# Altium schematic sheet DP83640.SchDoc
size A3; SheetNumber: 6; SheetTotal: 14
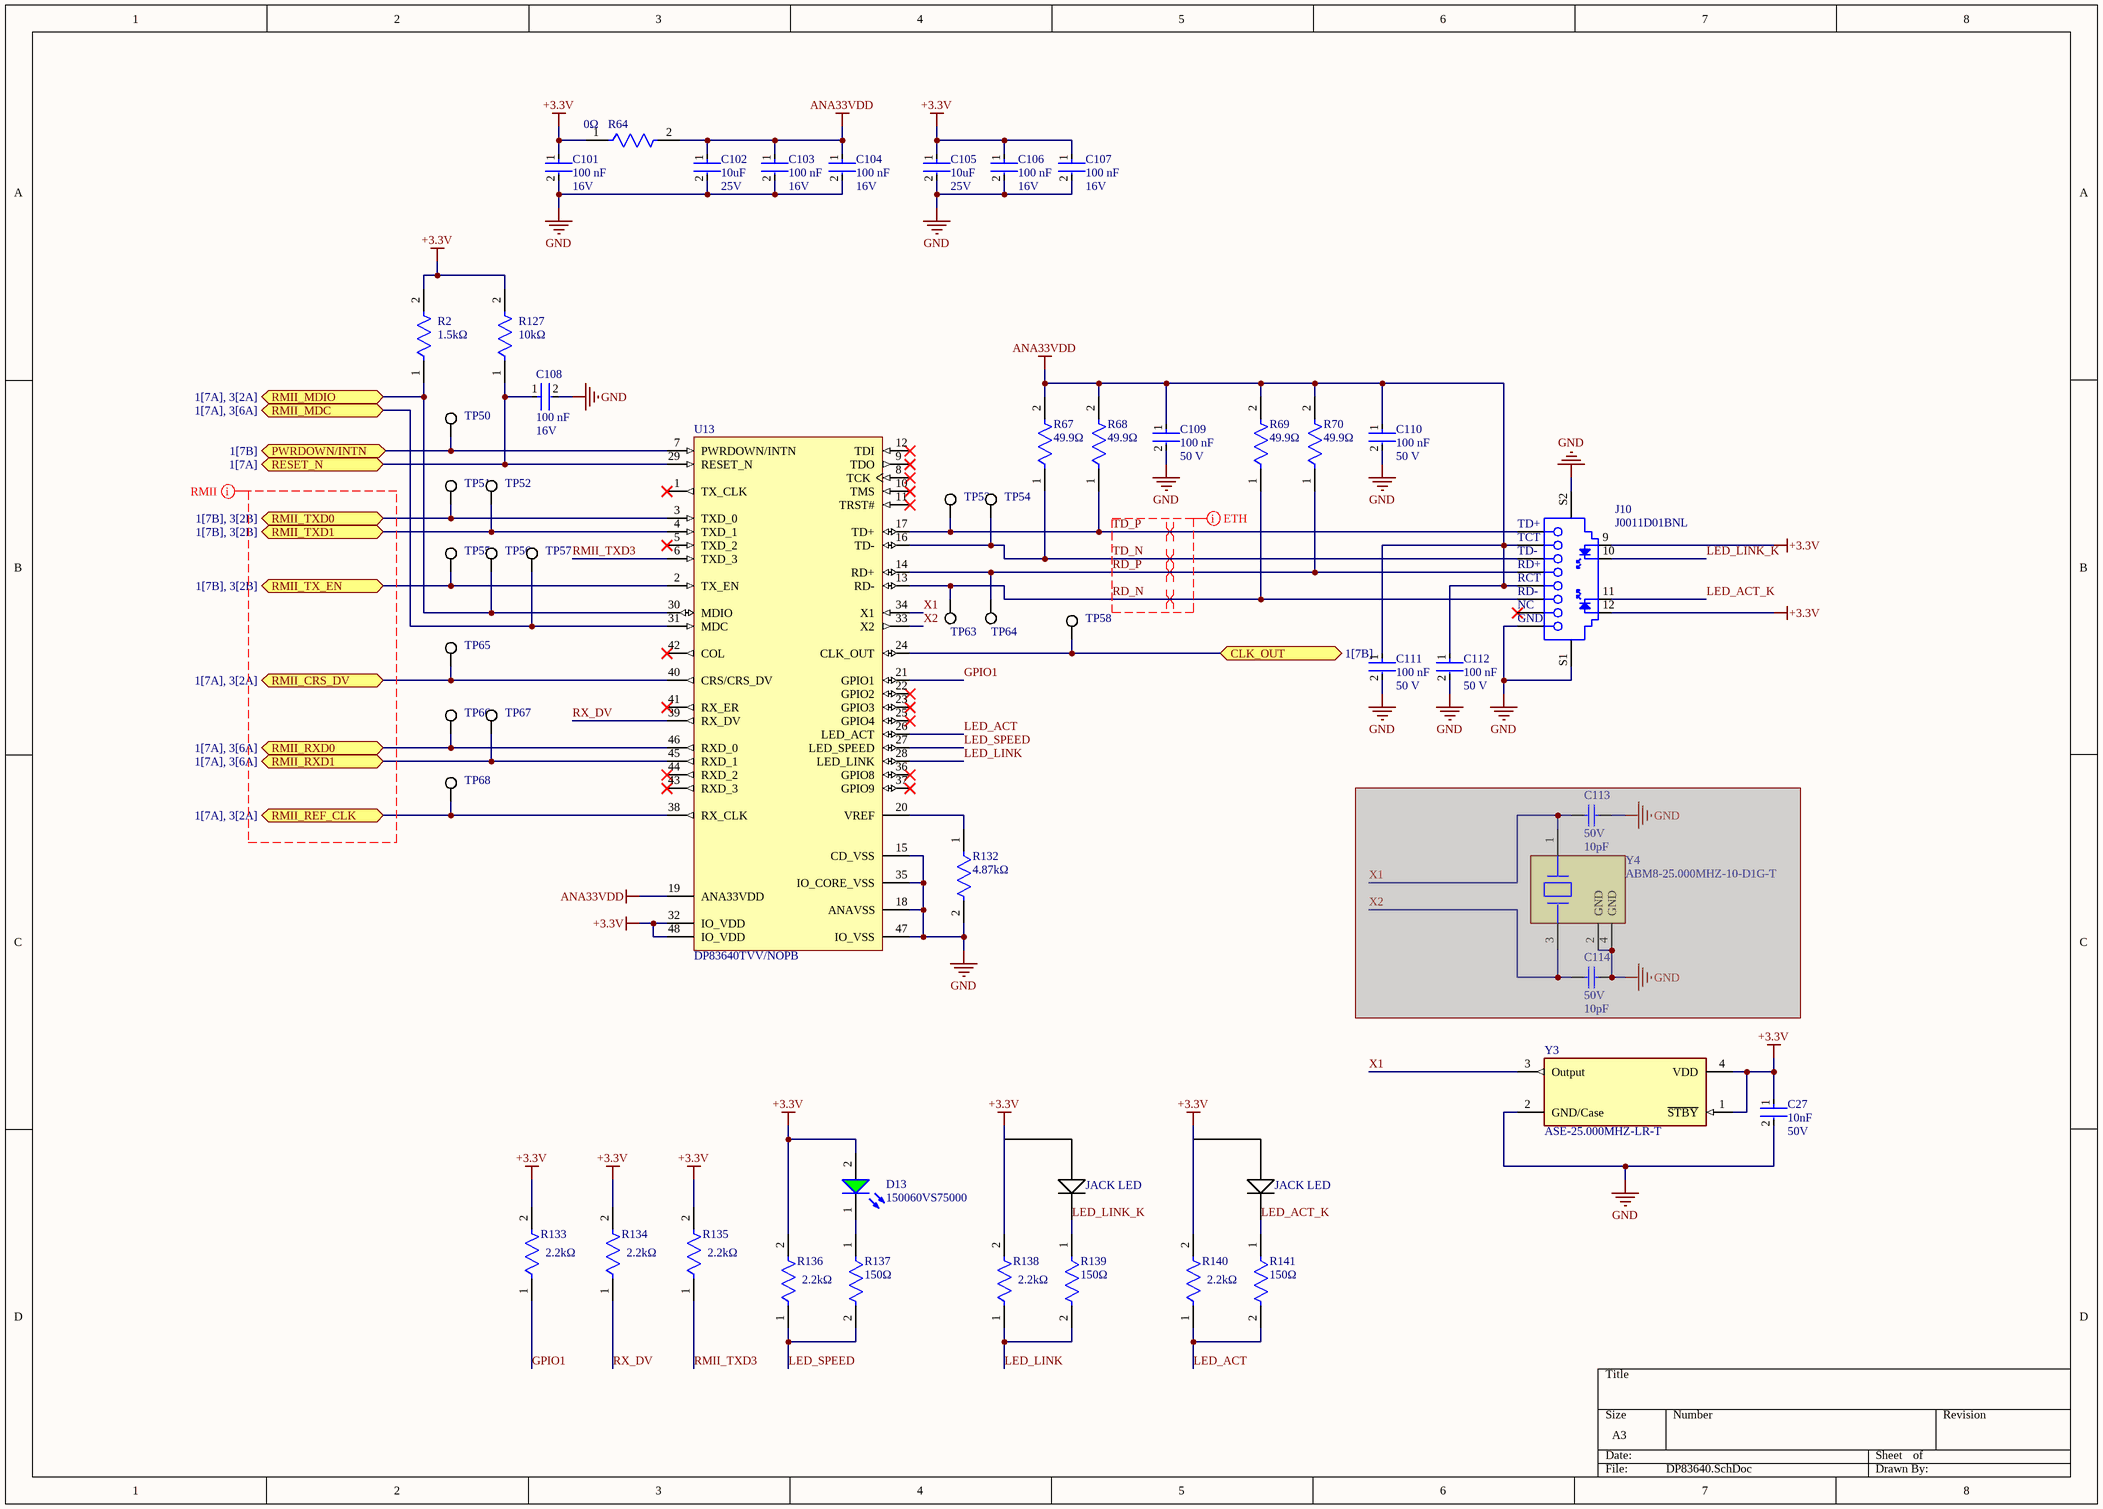
[diagram p0: DP83640.SchDoc]

## Parts
C27  Voltage: 50V  Capacitance: 10nF  [FP-CL165-IPC_B]  (hidden comment: CL05B103KB5NNNC)
C101  Capacitance: 100 nF  Voltage Rating: 16V  [FP-CL752-IPC_B]  (hidden comment: CL05B104KO5VPNC)
C102  Voltage Rating: 25V  Capacitance: 10uF  [FP-C1608-080-IPC_B]  (hidden comment: C1608X5R1E106M080AC)
C103  Capacitance: 100 nF  Voltage Rating: 16V  [FP-CL752-IPC_B]  (hidden comment: CL05B104KO5VPNC)
C104  Capacitance: 100 nF  Voltage Rating: 16V  [FP-CL752-IPC_B]  (hidden comment: CL05B104KO5VPNC)
C105  Voltage Rating: 25V  Capacitance: 10uF  [FP-C1608-080-IPC_B]  (hidden comment: C1608X5R1E106M080AC)
C106  Capacitance: 100 nF  Voltage Rating: 16V  [FP-CL752-IPC_B]  (hidden comment: CL05B104KO5VPNC)
C107  Capacitance: 100 nF  Voltage Rating: 16V  [FP-CL752-IPC_B]  (hidden comment: CL05B104KO5VPNC)
C108  Capacitance: 100 nF  Voltage Rating: 16V  [FP-CL752-IPC_B]  (hidden comment: CL05B104KO5VPNC)
C109  value 100 nF  Voltage Rating: 50 V  [FP-C0603C-CF-IPC_B]  (hidden comment: C0603C104M5RACTU)
C110  value 100 nF  Voltage Rating: 50 V  [FP-C0603C-CF-IPC_B]  (hidden comment: C0603C104M5RACTU)
C111  value 100 nF  Voltage Rating: 50 V  [FP-C0603C-CF-IPC_B]  (hidden comment: C0603C104M5RACTU)
C112  value 100 nF  Voltage Rating: 50 V  [FP-C0603C-CF-IPC_B]  (hidden comment: C0603C104M5RACTU)
C113  Voltage Rating: 50V  Capacitance: 10pF  [CAPC1005X55X25NL05T05]  (hidden comment: CC0402JRNPO9BN100)  (masked out: inside a compile mask, not in the netlist)
C114  Voltage Rating: 50V  Capacitance: 10pF  [CAPC1005X55X25NL05T05]  (hidden comment: CC0402JRNPO9BN100)  (masked out: inside a compile mask, not in the netlist)
D13  150060VS75000  [WL-SMCW_0603_150060xx75000]
J10  J0011D01BNL  [J0011D01BNL]
R2  Resistance: 1.5kΩ  [FP-CRCW0603-e3-IPC_B]  (hidden comment: CRCW06031K50FKEA)
R64  Resistance: 0Ω  [FP-CRCW0603-HPe3-IPC_B]  (hidden comment: CRCW06030000Z0EAHP)
R67  Resistance: 49.9Ω  [FP-AC0603-IPC_B]  (hidden comment: AC0603FR-0749R9L)
R68  Resistance: 49.9Ω  [FP-AC0603-IPC_B]  (hidden comment: AC0603FR-0749R9L)
R69  Resistance: 49.9Ω  [FP-AC0603-IPC_B]  (hidden comment: AC0603FR-0749R9L)
R70  Resistance: 49.9Ω  [FP-AC0603-IPC_B]  (hidden comment: AC0603FR-0749R9L)
R127  Resistance: 10kΩ  [FP-RC0603-0_55-IPC_B]  (hidden comment: RC0603FR-0710KL)
R132  Resistance: 4.87kΩ  [FP-CRCW0603-e3-IPC_B]  (hidden comment: CRCW06034K87FKEA)
R133  Resistance: 2.2kΩ  [FP-AC0603-IPC_B]  (hidden comment: AC0603FR-072K2L)
R134  Resistance: 2.2kΩ  [FP-AC0603-IPC_B]  (hidden comment: AC0603FR-072K2L)
R135  Resistance: 2.2kΩ  [FP-AC0603-IPC_B]  (hidden comment: AC0603FR-072K2L)
R136  Resistance: 2.2kΩ  [FP-AC0603-IPC_B]  (hidden comment: AC0603FR-072K2L)
R137  Resistance: 150Ω  [FP-CRCW0603-e3-IPC_B]  (hidden comment: CRCW0603150RFKEA)
R138  Resistance: 2.2kΩ  [FP-AC0603-IPC_B]  (hidden comment: AC0603FR-072K2L)
R139  Resistance: 150Ω  [FP-CRCW0603-e3-IPC_B]  (hidden comment: CRCW0603150RFKEA)
R140  Resistance: 2.2kΩ  [FP-AC0603-IPC_B]  (hidden comment: AC0603FR-072K2L)
R141  Resistance: 150Ω  [FP-CRCW0603-e3-IPC_B]  (hidden comment: CRCW0603150RFKEA)
TP50  5019  [KSTN-5019_V]  (value not drawn)
TP51  5019  [KSTN-5019_V]  (value not drawn)
TP52  5019  [KSTN-5019_V]  (value not drawn)
TP53  5019  [KSTN-5019_V]  (value not drawn)
TP54  5019  [KSTN-5019_V]  (value not drawn)
TP55  5019  [KSTN-5019_V]  (value not drawn)
TP56  5019  [KSTN-5019_V]  (value not drawn)
TP57  5019  [KSTN-5019_V]  (value not drawn)
TP58  5019  [KSTN-5019_V]  (value not drawn)
TP63  5019  [KSTN-5019_V]  (value not drawn)
TP64  5019  [KSTN-5019_V]  (value not drawn)
TP65  5019  [KSTN-5019_V]  (value not drawn)
TP66  5019  [KSTN-5019_V]  (value not drawn)
TP67  5019  [KSTN-5019_V]  (value not drawn)
TP68  5019  [KSTN-5019_V]  (value not drawn)
U13  DP83640TVV/NOPB  [PT0048A_M]
Y3  ASE-25.000MHZ-LR-T  [FP-ASE-MFG]
Y4  ABM8-25.000MHZ-10-D1G-T  [FP-ABM8-MFG]  (masked out: inside a compile mask, not in the netlist)

## Ports
CLK_OUT (bidir, see 1[7B]), PWRDOWN/INTN (bidir, see 1[7B]), RESET_N (bidir, see 1[7A]), RMII_CRS_DV (bidir, see 1[7A], 3[2A]), RMII_MDC (bidir, see 1[7A], 3[6A]), RMII_MDIO (bidir, see 1[7A], 3[2A]), RMII_REF_CLK (bidir, see 1[7A], 3[2A]), RMII_RXD0 (bidir, see 1[7A], 3[6A]), RMII_RXD1 (bidir, see 1[7A], 3[6A]), RMII_TX_EN (bidir, see 1[7B], 3[2B]), RMII_TXD0 (bidir, see 1[7B], 3[2B]), RMII_TXD1 (bidir, see 1[7B], 3[2B])

## Nets
+3.3V: C27.1 C101.1 C105.1 C106.1 C107.1 D13.2(A) J10.9 J10.12 R2.2 R64.1 R127.2 R133.2 R134.2 R135.2 R136.2 R138.2 R140.2 U13.32(IO_VDD) U13.48(IO_VDD) Y3.1(~{STBY}) Y3.4(VDD)
ANA33VDD: C102.1 C103.1 C104.1 C109.1 C110.1 C111.1 C112.1 J10.2(TCT) J10.5(RCT) R64.2 R67.2 R68.2 R69.2 R70.2 U13.19(ANA33VDD)
GND: C27.2 C101.2 C102.2 C103.2 C104.2 C105.2 C106.2 C107.2 C108.2 C109.2 C110.2 C111.2 C112.2 J10.8(GND) J10.S1 J10.S2 R132.2 U13.15(CD_VSS) U13.18(ANAVSS) U13.35(IO_CORE_VSS) U13.47(IO_VSS) Y3.2(GND/Case)
CLK_OUT: TP58.1 U13.24(CLK_OUT) ; port CLK_OUT
GPIO1: R133.1 U13.21(GPIO1)
LED_ACT: R140.1 R141.2 U13.26(LED_ACT)
LED_ACT_K: J10.11 R141.1
LED_LINK: R138.1 R139.2 U13.28(LED_LINK)
LED_LINK_K: J10.10 R139.1
LED_SPEED: R136.1 R137.2 U13.27(LED_SPEED)
PWRDOWN/INTN: TP50.1 U13.7(PWRDOWN/INTN) ; port PWRDOWN/INTN
RD_N: J10.6(RD-) R69.1 TP63.1 U13.13(RD-)
RD_P: J10.4(RD+) R70.1 TP64.1 U13.14(RD+)
RESET_N: C108.1 R127.1 U13.29(RESET_N) ; port RESET_N
RMII_CRS_DV: TP65.1 U13.40(CRS/CRS_DV) ; port RMII_CRS_DV
RMII_MDC: TP57.1 U13.31(MDC) ; port RMII_MDC
RMII_MDIO: R2.1 TP56.1 U13.30(MDIO) ; port RMII_MDIO
RMII_REF_CLK: TP68.1 U13.38(RX_CLK) ; port RMII_REF_CLK
RMII_RXD0: TP66.1 U13.46(RXD_0) ; port RMII_RXD0
RMII_RXD1: TP67.1 U13.45(RXD_1) ; port RMII_RXD1
RMII_TX_EN: TP55.1 U13.2(TX_EN) ; port RMII_TX_EN
RMII_TXD0: TP51.1 U13.3(TXD_0) ; port RMII_TXD0
RMII_TXD1: TP52.1 U13.4(TXD_1) ; port RMII_TXD1
RMII_TXD3: R135.1 U13.6(TXD_3)
RX_DV: R134.1 U13.39(RX_DV)
TD_N: J10.3(TD-) R67.1 TP54.1 U13.16(TD-)
TD_P: J10.1(TD+) R68.1 TP53.1 U13.17(TD+)
X1: U13.34(X1) Y3.3(Output)
X2: U13.33(X2)
NetD13_1: D13.1(K) R137.1
NetR132_1: R132.1 U13.20(VREF)

Not connected (* = marked no-connect by the designer): J10 7(NC)*; U13 1(TX_CLK)* 5(TXD_2)* 8(TCK)* 9(TDO)* 10(TMS)* 11(TRST#)* 12(TDI)* 22(GPIO2)* 23(GPIO3)* 25(GPIO4)* 36(GPIO8)* 37(GPIO9)* 41(RX_ER)* 42(COL)* 43(RXD_3)* 44(RXD_2)*

## Layout directives
differential pair: RD_N, RD_P, TD_N, TD_P
rule Matched Net Lengths [Tolerance = 0.5mm]; rule Width Constraint [Pref Impedance = 50.00ohms    Min Impedance = 50.00ohms    Max Impedance = 50.00ohms]; net class RMII: (no net found under the mark)
net class ETH; rule Differential Pairs Routing [Pref Gap = 0.254mm    Min Gap  = 0.254mm    Max Gap  = 0.254mmPref Width = 0.121mm    Min Width  = 0.096mm    Max Width  = 0.152mm]: RD_N, RD_P, TD_N, TD_P

## Notes on the sheet
- JACK LED

## Library data of the parts
C27 = CMP-13271-000387-1: Cap Ceramic 10nF 50V X7R ±10% SMD 0402 +125°C Paper T/R; Depth: 0.5mm; Length: 1mm; Lead Free: Lead Free; Case Code (Metric): 1005; Width: 0.02inch; Min Operating Temperature: -55°C; Thickness: 0.022inch; Package Quantity: 1; Mount: Surface Mount; Height: 0.5mm; Material: Ceramic; Tolerance: 10%; Case Code (Imperial): 0402; Radiation Hardening: No; Case/Package: 0402; Max Operating Temperature: 125°C; Voltage Rating (DC): 50V; Contact Plating: Tin; Packaging: Tape and Reel; Voltage Rating: 50V; Dielectric: X7R
C101 C103 C104 C106-C108 = CMP-13271-002128-1: Cap Ceramic 100nF 16V X7R ±10% SMD 0402 +125°C Paper T/R; Length: 0.039inch; Case Code (Metric): 1005; Thickness: 0.022inch; Max Operating Temperature: 125°C; Mount: Surface Mount; Features: Soft Termination; Width: 0.02inch; Min Operating Temperature: -55°C; Tolerance: 10%; Case/Package: 0402; Packaging: Cut Tape; Ratings: AEC-Q200; Case Code (Imperial): 0402; Lead Free: Lead Free
C102 C105 = CMP-2000-05442-2: CAP CER 10UF 25V X5R 0603; Dielectric Material: Ceramic; Tolerance: 20%; Dielectric: X5R; Length: 1.6mm; Termination: SMD/SMT; Depth: 0.8mm; RoHS Compliant: Yes; Construction: Flat; Weight: 7.1E-05oz; Thickness: 0.039inch; Packaging: Tape and Reel; Min Operating Temperature: -55°C; Case Code (Imperial): 0603; Case/Package: 0603; Height: 0.8mm; Case Code (Metric): 1608; Resistor Type: Ceramic; Voltage Rating (DC): 25V; Max Operating Temperature: 85°C; REACH SVHC: No SVHC; Lead Free: Lead Free; Series: C; Width: 0.8mm; Mount: Surface Mount; Package Quantity: 1
C109-C112 = CMP-2006-03068-2: CAP CER 0.1UF 50V 20% X7R 0603; Manufacturer: KEMET; Material: Ceramic; Tolerance: 0.2; Temperature Coefficient: 30ppm/°C; Automotive Grade: Grade 1; Capacitance: 0.10 μF; Temperature Range High: +125°C; Device Class L3: Ceramic Capacitors; Manufacturer Part Number: C0603C104M5RACTU; Height: 0.87mm; Category: Cap; RoHS: TRUE; Digikey Description: CAP CER 0.1UF 50V 20% X7R 0603; ComponentLink2URL: https://api.kemet.com/component-edge/download/datasheet/C0603C100J5GACAUTO.pdf; Lead Free: Yes; Temperature Range Low: -55°C; Device Class L1: Passive Components; ComponentLink2Description: Datasheet; Temperature Characteristic: X7R; Automotive: Yes; Temperature: -55°C to +125°C; Octopart: https://octopart.com/c0603c104m5ractu-kemet-11855687; Device Class L2: Capacitors; Package: C0603C-CF; Mouser Description: Multilayer Ceramic Capacitors MLCC - SMD/SMT 50volts 0.1uF X7R 20%
C113 C114 = CMP-2100-03589-1: Chip Capacitor, 10 pF, +/- 5%, 50 V, -55 to 125 degC, 0402 (1005 Metric), RoHS, Tape and Reel; Manufacturer: Yageo; Insulation Resistance: 100GR; Dielectric Material: Ceramic; Temperature Coefficient: 30ppm/degC; Dielectric: C0G; Termination: SMD/SMT; Package Reference: 0402; Voltage Rating (DC): 50V; Lead Free: LeadFree; Composition: Ceramic; Tolerance: 5%; Case Code (Metric): 1005; Packaging: TapeandReel; Manufacturer URL: http://www.yageo.com/; REACH SVHC: NoSVHC; Max Operating Temperature: 125degC; Length: 1mm; Mount: SurfaceMount; Depth: 0.5mm; Min Operating Temperature: -55degC; Number of Pins: 2; Width: 0.02inch; Datasheet Version: Rev. 14, 07/2016; Package Quantity: 1; Datasheet URL: http://www.yageo.com/documents/recent/UPY-GP_NP0_16V-to-50V_14.pdf; Case Code (Imperial): 0402; RoHSCompliant: True; Radiation Hardening: No; Height: 0.5mm; Case/Package: 0402; Thickness: 0.022inch; Package Description: 2-Pin Surface Mount Device, Body 1 x 0.5 mm; Voltage: 50V
D13 = CMP-1426-00006-6: NexarPartId: 29717778; Reverse Voltage: 5V; Forward Voltage: 2V; Viewing Angle: 140°; Luminous Intensity: 40mcd; Test Current: 20mA; Max Junction Temperature (Tj): 95°C; Wavelength: 570nm; Forward Current: 100mA; Color: Green; Lens Style: Clear, Rectangular; Power Dissipation: 72mW; Peak Wavelength: 572nm; Packaging: Tape and Reel; REACH SVHC: Unknown; Width: 800µm; Max Operating Temperature: 85°C; Number of Pins: 2; RoHS: Compliant; Dominant Wavelength: 570nm; Min Operating Temperature: -40°C; Case Code (Imperial): 0603; Height: 700µm; Length: 1.6mm; Case Code (Metric): 1608; Case/Package: 0603; Max Reverse Voltage (DC): 5V; Mount: Surface Mount
J10 = J0011D01BNL: CONN MAGJACK 1PORT 100 BASE-TX; Manufacturer: Pulse; Number of Contacts: 8; Shielding: Shielded; Gender: Female; Current Rating: 8mA; Connector Type: RJ45; Number of Ports: 1; Direction: Down; Number of Cores per Jack: 4; Pitch: 2.54mm; Supplier: Avnet; Supplier Part Number: J0011D01BNL; Manufacturer Part Number: J0011D01BNL; RoHS: Yes; Category: Modular / Ethernet Connectors; Stock: 870; Pricing: 330=5.61455, 390=5.49838, 720=5.38222, 1650=5.26606, 3300=5.14989, 16500=5.03373, 33000=4.93693 (USD); Mounting Technology: Through Hole; Contact Plating: Gold; Contact Material: Bronze; Color: Green,Yellow; Housing Material: Thermoplastic; Min Operating Temperature: 0°C; Max Operating Temperature: 70°C; Termination: Solder; Orientation: Right Angle; Package Quantity: 30; Number of Rows: 1; Packaging: Tray; Number of Positions Loaded: 8; Series: PULSEJACK™ J0; Length: 16.26mm; Depth: 21.59mm; Radiation Hardening: No; Lead Free: Lead Free; RoHS Compliant: Yes; ComponentLink1URL: https://datasheet.ciiva.com/3138/+j403-3138718.pdf?src-supplier=Avnet; ComponentLink1Description: https://datasheet.ciiva.com/3138/+j403-3138718.pdf?src-supplier=Avnet; Supplier 1: Avnet; Supplier Part Number 1: J0011D01BNL
R2 = CMP-2000-02995-2: RES Thick Film, 1.5kΩ, 1%, 0.1W, 100ppm/°C, 0603; Working Voltage: 75V; Power Rating: 100mW; Max Operating Temperature: 155°C; Features: Automotive AEC-Q200; Min Operating Temperature: -55°C; Width: 0.033inch; Case/Package: 0603; Voltage Rating (DC): 75V; Termination: SMD/SMT; Mount: Surface Mount; Weight: 7.1E-05oz; Case Code (Metric): 1608; Height: 0.45mm; Voltage Rating: 75V; Length: 1.55mm; Package Quantity: 10; Lead Free: Lead Free; Composition: Thick Film; Packaging: Tape and Reel; Temperature Coefficient: 100ppm/°C; Tolerance: 1%; Military Standard: Not; Case Code (Imperial): 0603; Number of Terminations: 2; Max Power Dissipation: 100mW; Depth: 0.85mm; Contact Plating: Tin
R64 = CMP-2000-03817-2: RES Thick Film, 0Ω, , 0.33W, , 0603; Max Power Dissipation: 250mW; Voltage Rating (DC): 75V; Temperature Coefficient: 0ppm/°C; Mount: Surface Mount; Package Quantity: 5000; Features: Automotive AEC-Q200; Length: 1.6mm; Width: 0.033inch; Min Operating Temperature: -55°C; Max Operating Temperature: 155°C; Contact Plating: Tin; Depth: 0.85mm; Case/Package: 0603; Radiation Hardening: No; Military Standard: Not; Power Rating: 250mW; Height: 0.45mm; Composition: Thick Film; Lead Free: Lead Free; Voltage Rating: 75V; Case Code (Imperial): 0603; Weight: 7.1E-05oz; Number of Terminations: 2; Packaging: Tape and Reel; Number of Pins: 2; Case Code (Metric): 1608; Termination: SMD/SMT
R67-R70 = CMP-03412-018485-2: RES 49.9Ω 1.00% 0.1W 0603; Temperature Coefficient: 100ppm/°C; Max Power Dissipation: 100mW; Voltage Rating: 50V; Tolerance: 1%; Series: AC; Case Code (Imperial): 0603; Features: Moisture Resistant; Case/Package: 0603; Width: 0.8mm; Case Code (Metric): 1608; Termination: SMD/SMT; Number of Terminations: 2; Power Rating: 100mW; RoHS Compliant: Yes; Height: 0.022inch; Min Operating Temperature: -55°C; Ratings: AEC-Q200; Packaging: Tape and Reel; Max Operating Temperature: 155°C; Resistor Type: Thick Film; Length: 0.063inch; Construction: Rectangular; Depth: 0.8mm; Military Standard: Not
R127 = CMP-2100-03664-2: RES 10K OHM 1% 1/10W 0603; Voltage Rating: 75V; Voltage Rating (DC): 50V; Power Rating: 100mW; Temperature Coefficient: 100ppm/°C; Depth: 0.8mm; Termination: SMD/SMT; Resistor Type: Thick Film; Series: RC; Construction: Rectangular; Features: Moisture Resistant; Packaging: Tape and Reel; Min Operating Temperature: -55°C; Number of Terminations: 2; Lead Pitch: 0.3mm; RoHS Compliant: Yes; Case/Package: 0603; Resistance Tolerance: 1%; Military Standard: Not; Weight: 7.1E-05oz; Number of Pins: 2; Tolerance: 1%; Length: 1.6mm; Case Code (Imperial): 0603; Lead Free: Lead Free; Width: 0.8mm; Max Power Dissipation: 100mW; Height: 0.45mm; Max Operating Temperature: 155°C; Case Code (Metric): 1608; Size Code: 0603
R132 = CMP-2000-03420-2: RES Thick Film, 4.87kΩ, 1%, 0.1W, 100ppm/°C, 0603; Max Power Dissipation: 100mW; Voltage Rating (DC): 75V; Package Quantity: 10; Case/Package: 0603; Case Code (Imperial): 0603; Termination: SMD/SMT; Number of Pins: 2; Tolerance: 1%; Case Code (Metric): 1608; Military Standard: Not; Power Rating: 100mW; Weight: 7.1E-05oz; Max Operating Temperature: 155°C; Radiation Hardening: No; Height: 0.45mm; Packaging: Tape and Reel; Temperature Coefficient: 100ppm/°C; Voltage Rating: 75V; Number of Terminations: 2; Min Operating Temperature: -55°C; Length: 1.55mm; Lead Free: Lead Free; Features: Automotive AEC-Q200; Composition: Thick Film; Depth: 0.85mm; Contact Plating: Tin; Width: 0.033inch
R133-R136 R138 R140 = CMP-2000-04835-3: RES 2.2KΩ 1.00% 0.1W 0603; Tolerance: 1%; Max Power Dissipation: 100mW; Temperature Coefficient: 100ppm/°C; Voltage Rating: 50V; Features: Moisture Resistant; Size Code: 0603; Termination: SMD/SMT; Packaging: Tape and Reel; Min Operating Temperature: -55°C; Case/Package: 0603; Width: 0.031inch; Case Code (Metric): 1608; Package Quantity: 1; Height: 0.022inch; Number of Terminations: 2; Depth: 0.8mm; Construction: Rectangular; Power Rating: 100mW; Ratings: AEC-Q200; Series: AC; Case Code (Imperial): 0603; RoHS Compliant: Yes; Resistor Type: Thick Film; Military Standard: Not; Length: 0.063inch; Max Operating Temperature: 155°C; Lead Free: Lead Free
R137 R139 R141 = CMP-2000-03913-2: RES Thick Film, 150Ω, 1%, 0.1W, 100ppm/°C, 0603; Voltage Rating (DC): 75V; Max Power Dissipation: 100mW; Features: Automotive AEC-Q200; Weight: 7.1E-05oz; Number of Terminations: 2; Temperature Coefficient: 100ppm/°C; Military Standard: Not; Length: 1.55mm; Min Operating Temperature: -55°C; Termination: SMD/SMT; Tolerance: 1%; Composition: Thick Film; Depth: 0.85mm; Max Operating Temperature: 155°C; Width: 0.033inch; Lead Free: Lead Free; Height: 0.45mm; Case Code (Metric): 1608; Package Quantity: 10; Case Code (Imperial): 0603; Voltage Rating: 75V; Radiation Hardening: No; Contact Plating: Tin; Mount: Surface Mount; Packaging: Tape and Reel; Power Rating: 100mW; Case/Package: 0603
TP50-TP58 TP63-TP68 = CMP-1672-00008-1: Test Point, 1 Position SMD, RoHS, Tape and Reel; ComponentLink1Description: Manufacturer URL; Package Quantity: 1000; DatasheetVersion: 03/2014; Packaging: Tape and Reel; ComponentLink2URL: http://www.keyelco.com/product-pdf.cfm?p=1357; ComponentLink1URL: http://www.keyelco.com/; Mount: Surface Mount; Contact Plating: Silver; PackageDescription: 1-Pin Surface Mount Device, Body 3.81 x 2.03 mm; Pins: 1; RoHSCompliant: True; Mounting Technology: Surface Mount; ComponentLink2Description: Datasheet; PackageReference: 5019
U13 = CMP-0058-00763-3: Precision PHYTER® - IEEE 1588 Precision Time Protocol Transceiver, 48-pin LQFP, Pb-Free; Manufacturer: Texas Instruments; PowerWise: N; CompType: Interface IC; PackageTopMarking: NSUZXYTT*DP83640*TVV; PackageDescription: LQFP, 7 x 7 x 1.4mm, 48 Lead, 0.5mm Pitch; ComponentLink1Description: Datasheet URL; RoHS: Y; ComponentLink1URL: http://www.ti.com/general/docs/lit/getliterature.tsp?genericPartNumber=DP83640&fileType=pdf; PackageReference: PT0048A; PinCount: 48
Y3 = CMP-27762-000357-1: XTAL Oscillator 25MHz ±25ppm CMOS 3.3V 4-SMD 3.2mm x 2.5mm; Min Supply Voltage: 3.135V; Max Supply Current: 13mA; Max Supply Voltage: 3.465V; Load Capacitance: 15pF; Height: 0.047inch; Series: ASE; Frequency Stability: 25ppm; Mount: Surface Mount; Case/Package: SMD/SMT; Width: 0.098inch; Operating Frequency: 25 MHz; REACH SVHC: No SVHC; Package Quantity: 1000; Number of Pins: 4; Termination: SMD/SMT; Frequency: 25MHz; Max Operating Temperature: 85°C; Packaging: Tape and Reel; Min Operating Temperature: -40°C; Lead Free: Lead Free; Length: 0.126inch; Operating Supply Voltage: 3.3V
Y4 = CMP-27762-010178-1: Crystal 25MHz ±10ppm 10pF SMD-4 3.2mm x 2.5mm; Frequency Stability: 15ppm; ESR (Equivalent Series Resistance): 50R; Mount: Surface Mount; Load Capacitance: 10pF; Frequency Tolerance: 10ppm; Max Operating Temperature: 85°C; Frequency: 25MHz; Case/Package: SMD/SMT; Length: 0.126inch; RoHS Compliant: Yes; Min Operating Temperature: -40°C; Width: 0.098inch; Height: 0.031inch; Packaging: Tape and Reel